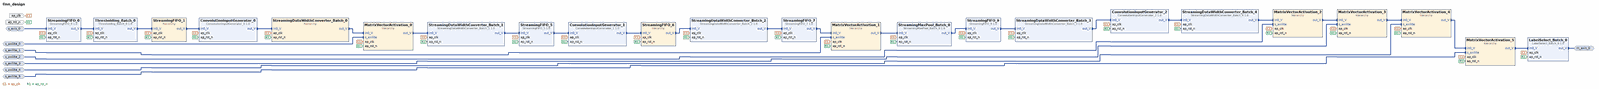
[diagram p0: block diagram of the top level, whole]
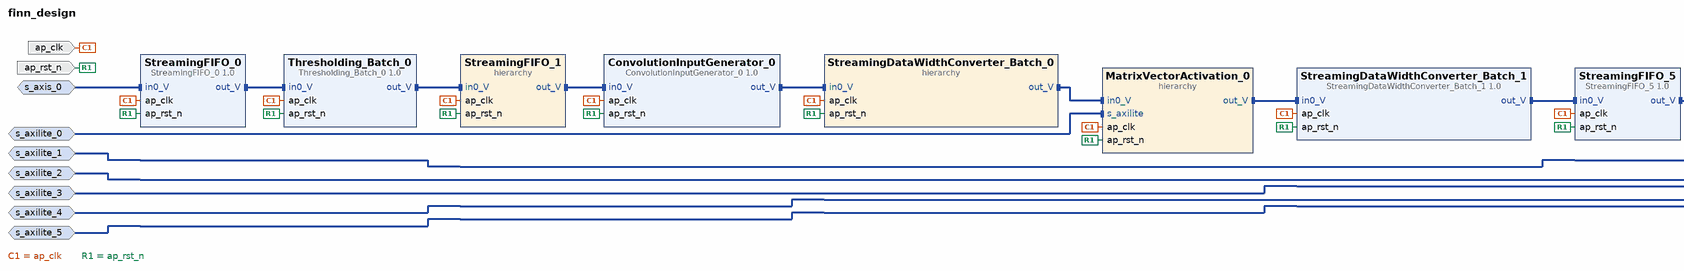
[diagram p1: block diagram of the top level, left part]
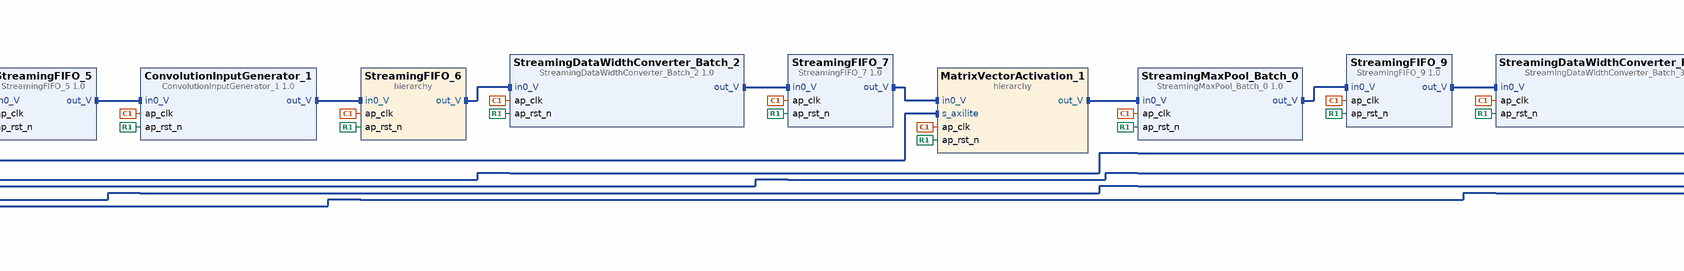
[diagram p2: block diagram of the top level, centre part]
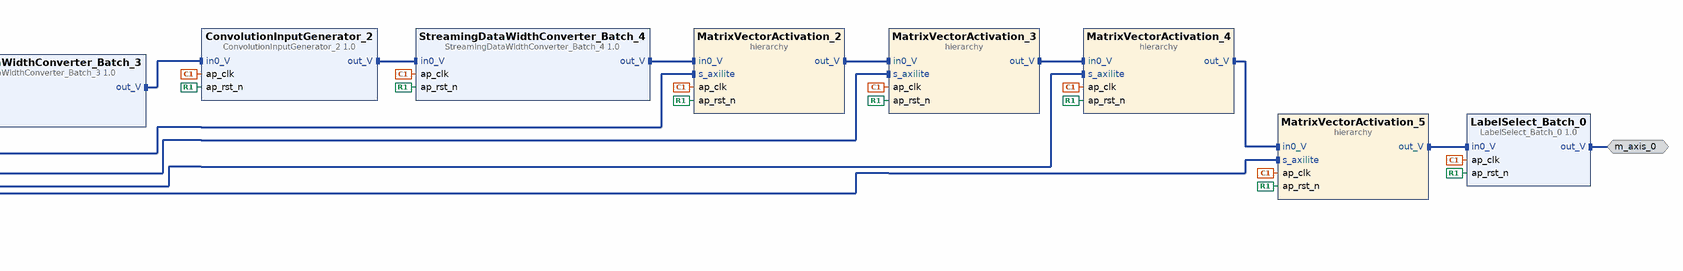
[diagram p3: block diagram of the top level, right part]
# Vivado block design finn_design, xc7z020clg400-1, Vivado 2022.2.2
create_bd_design finn_design

create_bd_intf_port -mode Slave -vlnv xilinx.com:interface:aximm_rtl:1.0 s_axilite_0
set_property -dict [list \
  CONFIG.ADDR_WIDTH 7 \
  CONFIG.ARUSER_WIDTH 0 \
  CONFIG.AWUSER_WIDTH 0 \
  CONFIG.BUSER_WIDTH 0 \
  CONFIG.DATA_WIDTH 32 \
  CONFIG.FREQ_HZ 100000000.000000 \
  CONFIG.HAS_BRESP 1 \
  CONFIG.HAS_BURST 0 \
  CONFIG.HAS_CACHE 0 \
  CONFIG.HAS_LOCK 0 \
  CONFIG.HAS_PROT 1 \
  CONFIG.HAS_QOS 0 \
  CONFIG.HAS_REGION 0 \
  CONFIG.HAS_RRESP 1 \
  CONFIG.HAS_WSTRB 1 \
  CONFIG.ID_WIDTH 0 \
  CONFIG.MAX_BURST_LENGTH 1 \
  CONFIG.NUM_READ_OUTSTANDING 1 \
  CONFIG.NUM_READ_THREADS 1 \
  CONFIG.NUM_WRITE_OUTSTANDING 1 \
  CONFIG.NUM_WRITE_THREADS 1 \
  CONFIG.PROTOCOL AXI4LITE \
  CONFIG.READ_WRITE_MODE READ_WRITE \
  CONFIG.RUSER_BITS_PER_BYTE 0 \
  CONFIG.RUSER_WIDTH 0 \
  CONFIG.SUPPORTS_NARROW_BURST 0 \
  CONFIG.WUSER_BITS_PER_BYTE 0 \
  CONFIG.WUSER_WIDTH 0 \
] [get_bd_intf_ports s_axilite_0]
create_bd_intf_port -mode Slave -vlnv xilinx.com:interface:aximm_rtl:1.0 s_axilite_1
set_property -dict [list \
  CONFIG.ADDR_WIDTH 12 \
  CONFIG.ARUSER_WIDTH 0 \
  CONFIG.AWUSER_WIDTH 0 \
  CONFIG.BUSER_WIDTH 0 \
  CONFIG.DATA_WIDTH 32 \
  CONFIG.FREQ_HZ 100000000.000000 \
  CONFIG.HAS_BRESP 1 \
  CONFIG.HAS_BURST 0 \
  CONFIG.HAS_CACHE 0 \
  CONFIG.HAS_LOCK 0 \
  CONFIG.HAS_PROT 1 \
  CONFIG.HAS_QOS 0 \
  CONFIG.HAS_REGION 0 \
  CONFIG.HAS_RRESP 1 \
  CONFIG.HAS_WSTRB 1 \
  CONFIG.ID_WIDTH 0 \
  CONFIG.MAX_BURST_LENGTH 1 \
  CONFIG.NUM_READ_OUTSTANDING 1 \
  CONFIG.NUM_READ_THREADS 1 \
  CONFIG.NUM_WRITE_OUTSTANDING 1 \
  CONFIG.NUM_WRITE_THREADS 1 \
  CONFIG.PROTOCOL AXI4LITE \
  CONFIG.READ_WRITE_MODE READ_WRITE \
  CONFIG.RUSER_BITS_PER_BYTE 0 \
  CONFIG.RUSER_WIDTH 0 \
  CONFIG.SUPPORTS_NARROW_BURST 0 \
  CONFIG.WUSER_BITS_PER_BYTE 0 \
  CONFIG.WUSER_WIDTH 0 \
] [get_bd_intf_ports s_axilite_1]
create_bd_intf_port -mode Slave -vlnv xilinx.com:interface:aximm_rtl:1.0 s_axilite_2
set_property -dict [list \
  CONFIG.ADDR_WIDTH 15 \
  CONFIG.ARUSER_WIDTH 0 \
  CONFIG.AWUSER_WIDTH 0 \
  CONFIG.BUSER_WIDTH 0 \
  CONFIG.DATA_WIDTH 32 \
  CONFIG.FREQ_HZ 100000000.000000 \
  CONFIG.HAS_BRESP 1 \
  CONFIG.HAS_BURST 0 \
  CONFIG.HAS_CACHE 0 \
  CONFIG.HAS_LOCK 0 \
  CONFIG.HAS_PROT 1 \
  CONFIG.HAS_QOS 0 \
  CONFIG.HAS_REGION 0 \
  CONFIG.HAS_RRESP 1 \
  CONFIG.HAS_WSTRB 1 \
  CONFIG.ID_WIDTH 0 \
  CONFIG.MAX_BURST_LENGTH 1 \
  CONFIG.NUM_READ_OUTSTANDING 1 \
  CONFIG.NUM_READ_THREADS 1 \
  CONFIG.NUM_WRITE_OUTSTANDING 1 \
  CONFIG.NUM_WRITE_THREADS 1 \
  CONFIG.PROTOCOL AXI4LITE \
  CONFIG.READ_WRITE_MODE READ_WRITE \
  CONFIG.RUSER_BITS_PER_BYTE 0 \
  CONFIG.RUSER_WIDTH 0 \
  CONFIG.SUPPORTS_NARROW_BURST 0 \
  CONFIG.WUSER_BITS_PER_BYTE 0 \
  CONFIG.WUSER_WIDTH 0 \
] [get_bd_intf_ports s_axilite_2]
create_bd_intf_port -mode Slave -vlnv xilinx.com:interface:aximm_rtl:1.0 s_axilite_3
set_property -dict [list \
  CONFIG.ADDR_WIDTH 11 \
  CONFIG.ARUSER_WIDTH 0 \
  CONFIG.AWUSER_WIDTH 0 \
  CONFIG.BUSER_WIDTH 0 \
  CONFIG.DATA_WIDTH 32 \
  CONFIG.FREQ_HZ 100000000.000000 \
  CONFIG.HAS_BRESP 1 \
  CONFIG.HAS_BURST 0 \
  CONFIG.HAS_CACHE 0 \
  CONFIG.HAS_LOCK 0 \
  CONFIG.HAS_PROT 1 \
  CONFIG.HAS_QOS 0 \
  CONFIG.HAS_REGION 0 \
  CONFIG.HAS_RRESP 1 \
  CONFIG.HAS_WSTRB 1 \
  CONFIG.ID_WIDTH 0 \
  CONFIG.MAX_BURST_LENGTH 1 \
  CONFIG.NUM_READ_OUTSTANDING 1 \
  CONFIG.NUM_READ_THREADS 1 \
  CONFIG.NUM_WRITE_OUTSTANDING 1 \
  CONFIG.NUM_WRITE_THREADS 1 \
  CONFIG.PROTOCOL AXI4LITE \
  CONFIG.READ_WRITE_MODE READ_WRITE \
  CONFIG.RUSER_BITS_PER_BYTE 0 \
  CONFIG.RUSER_WIDTH 0 \
  CONFIG.SUPPORTS_NARROW_BURST 0 \
  CONFIG.WUSER_BITS_PER_BYTE 0 \
  CONFIG.WUSER_WIDTH 0 \
] [get_bd_intf_ports s_axilite_3]
create_bd_intf_port -mode Slave -vlnv xilinx.com:interface:aximm_rtl:1.0 s_axilite_4
set_property -dict [list \
  CONFIG.ADDR_WIDTH 10 \
  CONFIG.ARUSER_WIDTH 0 \
  CONFIG.AWUSER_WIDTH 0 \
  CONFIG.BUSER_WIDTH 0 \
  CONFIG.DATA_WIDTH 32 \
  CONFIG.FREQ_HZ 100000000.000000 \
  CONFIG.HAS_BRESP 1 \
  CONFIG.HAS_BURST 0 \
  CONFIG.HAS_CACHE 0 \
  CONFIG.HAS_LOCK 0 \
  CONFIG.HAS_PROT 1 \
  CONFIG.HAS_QOS 0 \
  CONFIG.HAS_REGION 0 \
  CONFIG.HAS_RRESP 1 \
  CONFIG.HAS_WSTRB 1 \
  CONFIG.ID_WIDTH 0 \
  CONFIG.MAX_BURST_LENGTH 1 \
  CONFIG.NUM_READ_OUTSTANDING 1 \
  CONFIG.NUM_READ_THREADS 1 \
  CONFIG.NUM_WRITE_OUTSTANDING 1 \
  CONFIG.NUM_WRITE_THREADS 1 \
  CONFIG.PROTOCOL AXI4LITE \
  CONFIG.READ_WRITE_MODE READ_WRITE \
  CONFIG.RUSER_BITS_PER_BYTE 0 \
  CONFIG.RUSER_WIDTH 0 \
  CONFIG.SUPPORTS_NARROW_BURST 0 \
  CONFIG.WUSER_BITS_PER_BYTE 0 \
  CONFIG.WUSER_WIDTH 0 \
] [get_bd_intf_ports s_axilite_4]
create_bd_intf_port -mode Slave -vlnv xilinx.com:interface:aximm_rtl:1.0 s_axilite_5
set_property -dict [list \
  CONFIG.ADDR_WIDTH 9 \
  CONFIG.ARUSER_WIDTH 0 \
  CONFIG.AWUSER_WIDTH 0 \
  CONFIG.BUSER_WIDTH 0 \
  CONFIG.DATA_WIDTH 32 \
  CONFIG.FREQ_HZ 100000000.000000 \
  CONFIG.HAS_BRESP 1 \
  CONFIG.HAS_BURST 0 \
  CONFIG.HAS_CACHE 0 \
  CONFIG.HAS_LOCK 0 \
  CONFIG.HAS_PROT 1 \
  CONFIG.HAS_QOS 0 \
  CONFIG.HAS_REGION 0 \
  CONFIG.HAS_RRESP 1 \
  CONFIG.HAS_WSTRB 1 \
  CONFIG.ID_WIDTH 0 \
  CONFIG.MAX_BURST_LENGTH 1 \
  CONFIG.NUM_READ_OUTSTANDING 1 \
  CONFIG.NUM_READ_THREADS 1 \
  CONFIG.NUM_WRITE_OUTSTANDING 1 \
  CONFIG.NUM_WRITE_THREADS 1 \
  CONFIG.PROTOCOL AXI4LITE \
  CONFIG.READ_WRITE_MODE READ_WRITE \
  CONFIG.RUSER_BITS_PER_BYTE 0 \
  CONFIG.RUSER_WIDTH 0 \
  CONFIG.SUPPORTS_NARROW_BURST 0 \
  CONFIG.WUSER_BITS_PER_BYTE 0 \
  CONFIG.WUSER_WIDTH 0 \
] [get_bd_intf_ports s_axilite_5]
create_bd_intf_port -mode Slave -vlnv xilinx.com:interface:axis_rtl:1.0 s_axis_0
set_property -dict [list \
  CONFIG.FREQ_HZ 100000000.000000 \
  CONFIG.HAS_TKEEP 0 \
  CONFIG.HAS_TLAST 0 \
  CONFIG.HAS_TREADY 1 \
  CONFIG.HAS_TSTRB 0 \
  CONFIG.LAYERED_METADATA undef \
  CONFIG.TDATA_NUM_BYTES 1 \
  CONFIG.TDEST_WIDTH 0 \
  CONFIG.TID_WIDTH 0 \
  CONFIG.TUSER_WIDTH 0 \
] [get_bd_intf_ports s_axis_0]
create_bd_intf_port -mode Master -vlnv xilinx.com:interface:axis_rtl:1.0 m_axis_0
set_property -dict {CONFIG.FREQ_HZ 100000000.000000} [get_bd_intf_ports m_axis_0]
create_bd_port -dir I -type clk ap_clk
set_property -dict {CONFIG.FREQ_HZ 100000000.000000} [get_bd_ports ap_clk]
create_bd_port -dir I -type rst ap_rst_n

create_bd_cell -type ip -vlnv xilinx.com:hls:StreamingFIFO_0:1.0 StreamingFIFO_0
create_bd_cell -type ip -vlnv xilinx.com:hls:Thresholding_Batch_0:1.0 Thresholding_Batch_0
create_bd_cell -type hier StreamingFIFO_1
create_bd_cell -type ip -vlnv xilinx.com:hls:ConvolutionInputGenerator_0:1.0 ConvolutionInputGenerator_0
create_bd_cell -type hier StreamingDataWidthConverter_Batch_0
create_bd_cell -type hier MatrixVectorActivation_0
create_bd_cell -type ip -vlnv xilinx.com:hls:StreamingDataWidthConverter_Batch_1:1.0 StreamingDataWidthConverter_Batch_1
create_bd_cell -type ip -vlnv xilinx.com:hls:StreamingFIFO_5:1.0 StreamingFIFO_5
create_bd_cell -type ip -vlnv xilinx.com:hls:ConvolutionInputGenerator_1:1.0 ConvolutionInputGenerator_1
create_bd_cell -type hier StreamingFIFO_6
create_bd_cell -type ip -vlnv xilinx.com:hls:StreamingDataWidthConverter_Batch_2:1.0 StreamingDataWidthConverter_Batch_2
create_bd_cell -type ip -vlnv xilinx.com:hls:StreamingFIFO_7:1.0 StreamingFIFO_7
create_bd_cell -type hier MatrixVectorActivation_1
create_bd_cell -type ip -vlnv xilinx.com:hls:StreamingMaxPool_Batch_0:1.0 StreamingMaxPool_Batch_0
create_bd_cell -type ip -vlnv xilinx.com:hls:StreamingFIFO_9:1.0 StreamingFIFO_9
create_bd_cell -type ip -vlnv xilinx.com:hls:StreamingDataWidthConverter_Batch_3:1.0 StreamingDataWidthConverter_Batch_3
create_bd_cell -type ip -vlnv xilinx.com:hls:ConvolutionInputGenerator_2:1.0 ConvolutionInputGenerator_2
create_bd_cell -type ip -vlnv xilinx.com:hls:StreamingDataWidthConverter_Batch_4:1.0 StreamingDataWidthConverter_Batch_4
create_bd_cell -type hier MatrixVectorActivation_2
create_bd_cell -type hier MatrixVectorActivation_3
create_bd_cell -type hier MatrixVectorActivation_4
create_bd_cell -type hier MatrixVectorActivation_5
create_bd_cell -type ip -vlnv xilinx.com:hls:LabelSelect_Batch_0:1.0 LabelSelect_Batch_0

# ---- hierarchy /StreamingFIFO_1 ----
current_bd_instance /StreamingFIFO_1
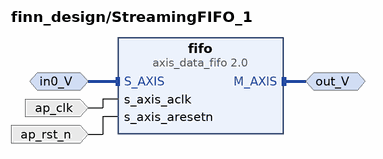
[diagram p4: block diagram inside /StreamingFIFO_1]
create_bd_intf_pin -mode Master -vlnv xilinx.com:interface:axis_rtl:1.0 out_V
create_bd_intf_pin -mode Slave -vlnv xilinx.com:interface:axis_rtl:1.0 in0_V
create_bd_pin -dir I -type clk ap_clk
create_bd_pin -dir I -type rst ap_rst_n

create_bd_cell -type ip -vlnv xilinx.com:ip:axis_data_fifo:2.0 fifo
set_property -dict {CONFIG.FIFO_DEPTH 512 CONFIG.FIFO_MEMORY_TYPE auto CONFIG.TDATA_NUM_BYTES 1} [get_bd_cells fifo]

# ---- hierarchy /StreamingDataWidthConverter_Batch_0 ----
current_bd_instance /StreamingDataWidthConverter_Batch_0
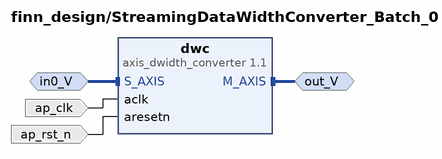
[diagram p5: block diagram inside /StreamingDataWidthConverter_Batch_0]
create_bd_intf_pin -mode Master -vlnv xilinx.com:interface:axis_rtl:1.0 out_V
create_bd_intf_pin -mode Slave -vlnv xilinx.com:interface:axis_rtl:1.0 in0_V
create_bd_pin -dir I -type clk ap_clk
create_bd_pin -dir I -type rst ap_rst_n

create_bd_cell -type ip -vlnv xilinx.com:ip:axis_dwidth_converter:1.1 dwc
set_property -dict {CONFIG.M_TDATA_NUM_BYTES 9 CONFIG.S_TDATA_NUM_BYTES 1} [get_bd_cells dwc]

# ---- hierarchy /MatrixVectorActivation_0 ----
current_bd_instance /MatrixVectorActivation_0
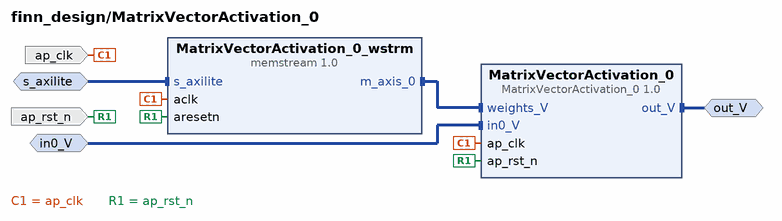
[diagram p6: block diagram inside /MatrixVectorActivation_0]
create_bd_intf_pin -mode Master -vlnv xilinx.com:interface:axis_rtl:1.0 out_V
create_bd_intf_pin -mode Slave -vlnv xilinx.com:interface:axis_rtl:1.0 in0_V
create_bd_intf_pin -mode Slave -vlnv xilinx.com:interface:aximm_rtl:1.0 s_axilite
create_bd_pin -dir I -type clk ap_clk
create_bd_pin -dir I -type rst ap_rst_n

create_bd_cell -type ip -vlnv xilinx.com:hls:MatrixVectorActivation_0:1.0 MatrixVectorActivation_0
create_bd_cell -type ip -vlnv xilinx.com:user:memstream:1.0 MatrixVectorActivation_0_wstrm
set_property -dict [list \
  CONFIG.MEM_DEPTH 28 \
  CONFIG.MEM_INIT /tmp/finn_dev_shakeelarkam00/code_gen_ipgen_MatrixVectorActivation_0_0xiospj5/ \
  CONFIG.MEM_WIDTH 32 \
  CONFIG.NSTREAMS 1 \
  CONFIG.RAM_STYLE auto \
  CONFIG.STRM0_DEPTH 28 \
  CONFIG.STRM0_OFFSET 0 \
  CONFIG.STRM0_WIDTH 32 \
] [get_bd_cells MatrixVectorActivation_0_wstrm]

# ---- hierarchy /StreamingFIFO_6 ----
current_bd_instance /StreamingFIFO_6
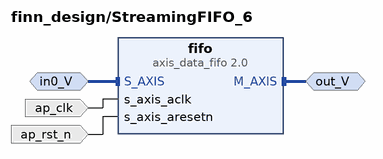
[diagram p7: block diagram inside /StreamingFIFO_6]
create_bd_intf_pin -mode Master -vlnv xilinx.com:interface:axis_rtl:1.0 out_V
create_bd_intf_pin -mode Slave -vlnv xilinx.com:interface:axis_rtl:1.0 in0_V
create_bd_pin -dir I -type clk ap_clk
create_bd_pin -dir I -type rst ap_rst_n

create_bd_cell -type ip -vlnv xilinx.com:ip:axis_data_fifo:2.0 fifo
set_property -dict {CONFIG.FIFO_DEPTH 4096 CONFIG.FIFO_MEMORY_TYPE auto CONFIG.TDATA_NUM_BYTES 3} [get_bd_cells fifo]

# ---- hierarchy /MatrixVectorActivation_1 ----
current_bd_instance /MatrixVectorActivation_1
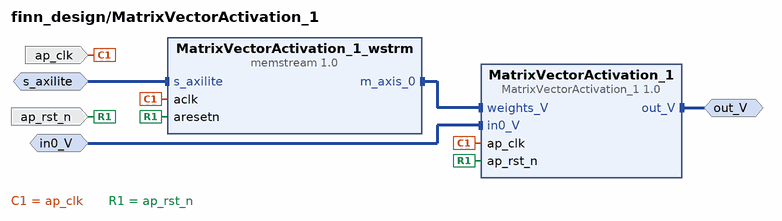
[diagram p8: block diagram inside /MatrixVectorActivation_1]
create_bd_intf_pin -mode Master -vlnv xilinx.com:interface:axis_rtl:1.0 out_V
create_bd_intf_pin -mode Slave -vlnv xilinx.com:interface:axis_rtl:1.0 in0_V
create_bd_intf_pin -mode Slave -vlnv xilinx.com:interface:aximm_rtl:1.0 s_axilite
create_bd_pin -dir I -type clk ap_clk
create_bd_pin -dir I -type rst ap_rst_n

create_bd_cell -type ip -vlnv xilinx.com:hls:MatrixVectorActivation_1:1.0 MatrixVectorActivation_1
create_bd_cell -type ip -vlnv xilinx.com:user:memstream:1.0 MatrixVectorActivation_1_wstrm
set_property -dict [list \
  CONFIG.MEM_DEPTH 84 \
  CONFIG.MEM_INIT /tmp/finn_dev_shakeelarkam00/code_gen_ipgen_MatrixVectorActivation_1_uhotd8eg/ \
  CONFIG.MEM_WIDTH 192 \
  CONFIG.NSTREAMS 1 \
  CONFIG.RAM_STYLE auto \
  CONFIG.STRM0_DEPTH 84 \
  CONFIG.STRM0_OFFSET 0 \
  CONFIG.STRM0_WIDTH 192 \
] [get_bd_cells MatrixVectorActivation_1_wstrm]

# ---- hierarchy /MatrixVectorActivation_2 ----
current_bd_instance /MatrixVectorActivation_2
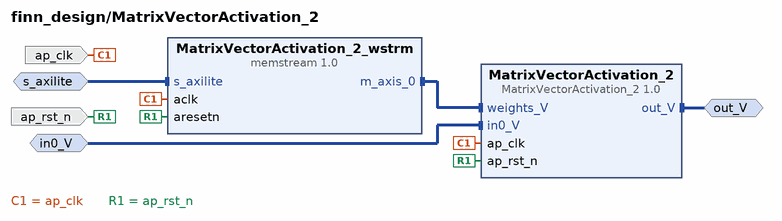
[diagram p9: block diagram inside /MatrixVectorActivation_2]
create_bd_intf_pin -mode Master -vlnv xilinx.com:interface:axis_rtl:1.0 out_V
create_bd_intf_pin -mode Slave -vlnv xilinx.com:interface:axis_rtl:1.0 in0_V
create_bd_intf_pin -mode Slave -vlnv xilinx.com:interface:aximm_rtl:1.0 s_axilite
create_bd_pin -dir I -type clk ap_clk
create_bd_pin -dir I -type rst ap_rst_n

create_bd_cell -type ip -vlnv xilinx.com:hls:MatrixVectorActivation_2:1.0 MatrixVectorActivation_2
create_bd_cell -type ip -vlnv xilinx.com:user:memstream:1.0 MatrixVectorActivation_2_wstrm
set_property -dict [list \
  CONFIG.MEM_DEPTH 7938 \
  CONFIG.MEM_INIT /tmp/finn_dev_shakeelarkam00/code_gen_ipgen_MatrixVectorActivation_2_539kjxr7/ \
  CONFIG.MEM_WIDTH 8 \
  CONFIG.NSTREAMS 1 \
  CONFIG.RAM_STYLE auto \
  CONFIG.STRM0_DEPTH 7938 \
  CONFIG.STRM0_OFFSET 0 \
  CONFIG.STRM0_WIDTH 8 \
] [get_bd_cells MatrixVectorActivation_2_wstrm]

# ---- hierarchy /MatrixVectorActivation_3 ----
current_bd_instance /MatrixVectorActivation_3
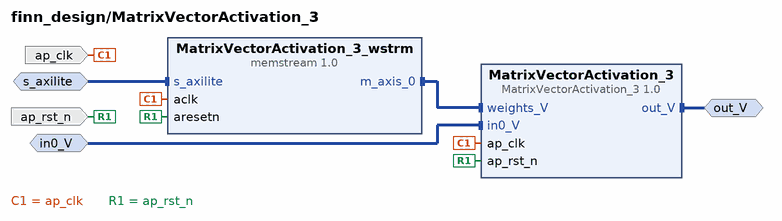
[diagram p10: block diagram inside /MatrixVectorActivation_3]
create_bd_intf_pin -mode Master -vlnv xilinx.com:interface:axis_rtl:1.0 out_V
create_bd_intf_pin -mode Slave -vlnv xilinx.com:interface:axis_rtl:1.0 in0_V
create_bd_intf_pin -mode Slave -vlnv xilinx.com:interface:aximm_rtl:1.0 s_axilite
create_bd_pin -dir I -type clk ap_clk
create_bd_pin -dir I -type rst ap_rst_n

create_bd_cell -type ip -vlnv xilinx.com:hls:MatrixVectorActivation_3:1.0 MatrixVectorActivation_3
create_bd_cell -type ip -vlnv xilinx.com:user:memstream:1.0 MatrixVectorActivation_3_wstrm
set_property -dict [list \
  CONFIG.MEM_DEPTH 336 \
  CONFIG.MEM_INIT /tmp/finn_dev_shakeelarkam00/code_gen_ipgen_MatrixVectorActivation_3_nupkdj_i/ \
  CONFIG.MEM_WIDTH 8 \
  CONFIG.NSTREAMS 1 \
  CONFIG.RAM_STYLE auto \
  CONFIG.STRM0_DEPTH 336 \
  CONFIG.STRM0_OFFSET 0 \
  CONFIG.STRM0_WIDTH 8 \
] [get_bd_cells MatrixVectorActivation_3_wstrm]

# ---- hierarchy /MatrixVectorActivation_4 ----
current_bd_instance /MatrixVectorActivation_4
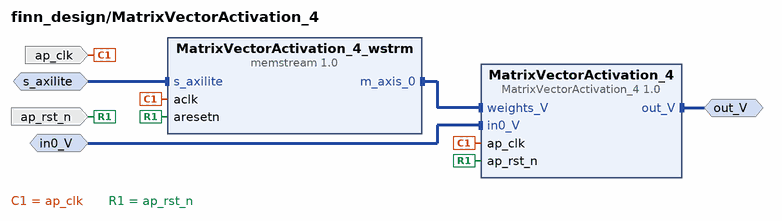
[diagram p11: block diagram inside /MatrixVectorActivation_4]
create_bd_intf_pin -mode Master -vlnv xilinx.com:interface:axis_rtl:1.0 out_V
create_bd_intf_pin -mode Slave -vlnv xilinx.com:interface:axis_rtl:1.0 in0_V
create_bd_intf_pin -mode Slave -vlnv xilinx.com:interface:aximm_rtl:1.0 s_axilite
create_bd_pin -dir I -type clk ap_clk
create_bd_pin -dir I -type rst ap_rst_n

create_bd_cell -type ip -vlnv xilinx.com:hls:MatrixVectorActivation_4:1.0 MatrixVectorActivation_4
create_bd_cell -type ip -vlnv xilinx.com:user:memstream:1.0 MatrixVectorActivation_4_wstrm
set_property -dict [list \
  CONFIG.MEM_DEPTH 256 \
  CONFIG.MEM_INIT /tmp/finn_dev_shakeelarkam00/code_gen_ipgen_MatrixVectorActivation_4_71mmt5md/ \
  CONFIG.MEM_WIDTH 8 \
  CONFIG.NSTREAMS 1 \
  CONFIG.RAM_STYLE auto \
  CONFIG.STRM0_DEPTH 256 \
  CONFIG.STRM0_OFFSET 0 \
  CONFIG.STRM0_WIDTH 8 \
] [get_bd_cells MatrixVectorActivation_4_wstrm]

# ---- hierarchy /MatrixVectorActivation_5 ----
current_bd_instance /MatrixVectorActivation_5
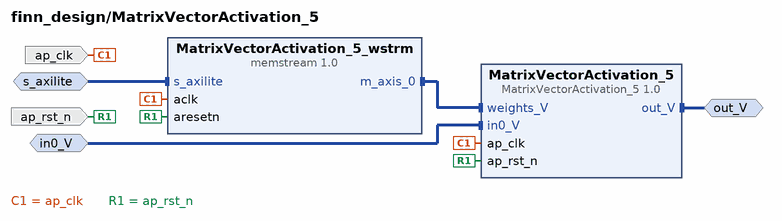
[diagram p12: block diagram inside /MatrixVectorActivation_5]
create_bd_intf_pin -mode Master -vlnv xilinx.com:interface:axis_rtl:1.0 out_V
create_bd_intf_pin -mode Slave -vlnv xilinx.com:interface:axis_rtl:1.0 in0_V
create_bd_intf_pin -mode Slave -vlnv xilinx.com:interface:aximm_rtl:1.0 s_axilite
create_bd_pin -dir I -type clk ap_clk
create_bd_pin -dir I -type rst ap_rst_n

create_bd_cell -type ip -vlnv xilinx.com:hls:MatrixVectorActivation_5:1.0 MatrixVectorActivation_5
create_bd_cell -type ip -vlnv xilinx.com:user:memstream:1.0 MatrixVectorActivation_5_wstrm
set_property -dict [list \
  CONFIG.MEM_DEPTH 80 \
  CONFIG.MEM_INIT /tmp/finn_dev_shakeelarkam00/code_gen_ipgen_MatrixVectorActivation_5_736cdvx1/ \
  CONFIG.MEM_WIDTH 8 \
  CONFIG.NSTREAMS 1 \
  CONFIG.RAM_STYLE auto \
  CONFIG.STRM0_DEPTH 80 \
  CONFIG.STRM0_OFFSET 0 \
  CONFIG.STRM0_WIDTH 8 \
] [get_bd_cells MatrixVectorActivation_5_wstrm]

# ---- connections ----

current_bd_instance /StreamingFIFO_1
connect_bd_intf_net [get_bd_intf_pins out_V] [get_bd_intf_pins fifo/M_AXIS]
connect_bd_intf_net [get_bd_intf_pins in0_V] [get_bd_intf_pins fifo/S_AXIS]
connect_bd_net [get_bd_pins ap_clk] [get_bd_pins fifo/s_axis_aclk]
connect_bd_net [get_bd_pins ap_rst_n] [get_bd_pins fifo/s_axis_aresetn]

current_bd_instance /StreamingDataWidthConverter_Batch_0
connect_bd_intf_net [get_bd_intf_pins out_V] [get_bd_intf_pins dwc/M_AXIS]
connect_bd_intf_net [get_bd_intf_pins in0_V] [get_bd_intf_pins dwc/S_AXIS]
connect_bd_net [get_bd_pins ap_clk] [get_bd_pins dwc/aclk]
connect_bd_net [get_bd_pins ap_rst_n] [get_bd_pins dwc/aresetn]

current_bd_instance /MatrixVectorActivation_0
connect_bd_intf_net [get_bd_intf_pins out_V] [get_bd_intf_pins MatrixVectorActivation_0/out_V]
connect_bd_intf_net [get_bd_intf_pins MatrixVectorActivation_0_wstrm/m_axis_0] [get_bd_intf_pins MatrixVectorActivation_0/weights_V]
connect_bd_intf_net [get_bd_intf_pins in0_V] [get_bd_intf_pins MatrixVectorActivation_0/in0_V]
connect_bd_intf_net [get_bd_intf_pins s_axilite] [get_bd_intf_pins MatrixVectorActivation_0_wstrm/s_axilite]
connect_bd_net [get_bd_pins ap_clk] [get_bd_pins MatrixVectorActivation_0_wstrm/aclk] [get_bd_pins MatrixVectorActivation_0/ap_clk]
connect_bd_net [get_bd_pins ap_rst_n] [get_bd_pins MatrixVectorActivation_0_wstrm/aresetn] [get_bd_pins MatrixVectorActivation_0/ap_rst_n]

current_bd_instance /StreamingFIFO_6
connect_bd_intf_net [get_bd_intf_pins out_V] [get_bd_intf_pins fifo/M_AXIS]
connect_bd_intf_net [get_bd_intf_pins in0_V] [get_bd_intf_pins fifo/S_AXIS]
connect_bd_net [get_bd_pins ap_clk] [get_bd_pins fifo/s_axis_aclk]
connect_bd_net [get_bd_pins ap_rst_n] [get_bd_pins fifo/s_axis_aresetn]

current_bd_instance /MatrixVectorActivation_1
connect_bd_intf_net [get_bd_intf_pins out_V] [get_bd_intf_pins MatrixVectorActivation_1/out_V]
connect_bd_intf_net [get_bd_intf_pins MatrixVectorActivation_1_wstrm/m_axis_0] [get_bd_intf_pins MatrixVectorActivation_1/weights_V]
connect_bd_intf_net [get_bd_intf_pins in0_V] [get_bd_intf_pins MatrixVectorActivation_1/in0_V]
connect_bd_intf_net [get_bd_intf_pins s_axilite] [get_bd_intf_pins MatrixVectorActivation_1_wstrm/s_axilite]
connect_bd_net [get_bd_pins ap_clk] [get_bd_pins MatrixVectorActivation_1_wstrm/aclk] [get_bd_pins MatrixVectorActivation_1/ap_clk]
connect_bd_net [get_bd_pins ap_rst_n] [get_bd_pins MatrixVectorActivation_1_wstrm/aresetn] [get_bd_pins MatrixVectorActivation_1/ap_rst_n]

current_bd_instance /MatrixVectorActivation_2
connect_bd_intf_net [get_bd_intf_pins out_V] [get_bd_intf_pins MatrixVectorActivation_2/out_V]
connect_bd_intf_net [get_bd_intf_pins MatrixVectorActivation_2_wstrm/m_axis_0] [get_bd_intf_pins MatrixVectorActivation_2/weights_V]
connect_bd_intf_net [get_bd_intf_pins in0_V] [get_bd_intf_pins MatrixVectorActivation_2/in0_V]
connect_bd_intf_net [get_bd_intf_pins s_axilite] [get_bd_intf_pins MatrixVectorActivation_2_wstrm/s_axilite]
connect_bd_net [get_bd_pins ap_clk] [get_bd_pins MatrixVectorActivation_2_wstrm/aclk] [get_bd_pins MatrixVectorActivation_2/ap_clk]
connect_bd_net [get_bd_pins ap_rst_n] [get_bd_pins MatrixVectorActivation_2_wstrm/aresetn] [get_bd_pins MatrixVectorActivation_2/ap_rst_n]

current_bd_instance /MatrixVectorActivation_3
connect_bd_intf_net [get_bd_intf_pins out_V] [get_bd_intf_pins MatrixVectorActivation_3/out_V]
connect_bd_intf_net [get_bd_intf_pins MatrixVectorActivation_3_wstrm/m_axis_0] [get_bd_intf_pins MatrixVectorActivation_3/weights_V]
connect_bd_intf_net [get_bd_intf_pins in0_V] [get_bd_intf_pins MatrixVectorActivation_3/in0_V]
connect_bd_intf_net [get_bd_intf_pins s_axilite] [get_bd_intf_pins MatrixVectorActivation_3_wstrm/s_axilite]
connect_bd_net [get_bd_pins ap_clk] [get_bd_pins MatrixVectorActivation_3_wstrm/aclk] [get_bd_pins MatrixVectorActivation_3/ap_clk]
connect_bd_net [get_bd_pins ap_rst_n] [get_bd_pins MatrixVectorActivation_3_wstrm/aresetn] [get_bd_pins MatrixVectorActivation_3/ap_rst_n]

current_bd_instance /MatrixVectorActivation_4
connect_bd_intf_net [get_bd_intf_pins out_V] [get_bd_intf_pins MatrixVectorActivation_4/out_V]
connect_bd_intf_net [get_bd_intf_pins MatrixVectorActivation_4_wstrm/m_axis_0] [get_bd_intf_pins MatrixVectorActivation_4/weights_V]
connect_bd_intf_net [get_bd_intf_pins in0_V] [get_bd_intf_pins MatrixVectorActivation_4/in0_V]
connect_bd_intf_net [get_bd_intf_pins s_axilite] [get_bd_intf_pins MatrixVectorActivation_4_wstrm/s_axilite]
connect_bd_net [get_bd_pins ap_clk] [get_bd_pins MatrixVectorActivation_4_wstrm/aclk] [get_bd_pins MatrixVectorActivation_4/ap_clk]
connect_bd_net [get_bd_pins ap_rst_n] [get_bd_pins MatrixVectorActivation_4_wstrm/aresetn] [get_bd_pins MatrixVectorActivation_4/ap_rst_n]

current_bd_instance /MatrixVectorActivation_5
connect_bd_intf_net [get_bd_intf_pins out_V] [get_bd_intf_pins MatrixVectorActivation_5/out_V]
connect_bd_intf_net [get_bd_intf_pins MatrixVectorActivation_5_wstrm/m_axis_0] [get_bd_intf_pins MatrixVectorActivation_5/weights_V]
connect_bd_intf_net [get_bd_intf_pins in0_V] [get_bd_intf_pins MatrixVectorActivation_5/in0_V]
connect_bd_intf_net [get_bd_intf_pins s_axilite] [get_bd_intf_pins MatrixVectorActivation_5_wstrm/s_axilite]
connect_bd_net [get_bd_pins ap_clk] [get_bd_pins MatrixVectorActivation_5_wstrm/aclk] [get_bd_pins MatrixVectorActivation_5/ap_clk]
connect_bd_net [get_bd_pins ap_rst_n] [get_bd_pins MatrixVectorActivation_5_wstrm/aresetn] [get_bd_pins MatrixVectorActivation_5/ap_rst_n]

current_bd_instance /
connect_bd_intf_net [get_bd_intf_pins ConvolutionInputGenerator_0/out_V] [get_bd_intf_pins StreamingDataWidthConverter_Batch_0/in0_V]
connect_bd_intf_net [get_bd_intf_pins ConvolutionInputGenerator_1/out_V] [get_bd_intf_pins StreamingFIFO_6/in0_V]
connect_bd_intf_net [get_bd_intf_pins ConvolutionInputGenerator_2/out_V] [get_bd_intf_pins StreamingDataWidthConverter_Batch_4/in0_V]
connect_bd_intf_net [get_bd_intf_ports m_axis_0] [get_bd_intf_pins LabelSelect_Batch_0/out_V]
connect_bd_intf_net [get_bd_intf_pins MatrixVectorActivation_0/out_V] [get_bd_intf_pins StreamingDataWidthConverter_Batch_1/in0_V]
connect_bd_intf_net [get_bd_intf_pins MatrixVectorActivation_1/out_V] [get_bd_intf_pins StreamingMaxPool_Batch_0/in0_V]
connect_bd_intf_net [get_bd_intf_pins MatrixVectorActivation_2/out_V] [get_bd_intf_pins MatrixVectorActivation_3/in0_V]
connect_bd_intf_net [get_bd_intf_pins MatrixVectorActivation_3/out_V] [get_bd_intf_pins MatrixVectorActivation_4/in0_V]
connect_bd_intf_net [get_bd_intf_pins MatrixVectorActivation_4/out_V] [get_bd_intf_pins MatrixVectorActivation_5/in0_V]
connect_bd_intf_net [get_bd_intf_pins MatrixVectorActivation_5/out_V] [get_bd_intf_pins LabelSelect_Batch_0/in0_V]
connect_bd_intf_net [get_bd_intf_pins StreamingDataWidthConverter_Batch_0/out_V] [get_bd_intf_pins MatrixVectorActivation_0/in0_V]
connect_bd_intf_net [get_bd_intf_pins StreamingDataWidthConverter_Batch_1/out_V] [get_bd_intf_pins StreamingFIFO_5/in0_V]
connect_bd_intf_net [get_bd_intf_pins StreamingDataWidthConverter_Batch_2/out_V] [get_bd_intf_pins StreamingFIFO_7/in0_V]
connect_bd_intf_net [get_bd_intf_pins StreamingDataWidthConverter_Batch_3/out_V] [get_bd_intf_pins ConvolutionInputGenerator_2/in0_V]
connect_bd_intf_net [get_bd_intf_pins StreamingDataWidthConverter_Batch_4/out_V] [get_bd_intf_pins MatrixVectorActivation_2/in0_V]
connect_bd_intf_net [get_bd_intf_pins StreamingFIFO_0/out_V] [get_bd_intf_pins Thresholding_Batch_0/in0_V]
connect_bd_intf_net [get_bd_intf_pins StreamingFIFO_1/out_V] [get_bd_intf_pins ConvolutionInputGenerator_0/in0_V]
connect_bd_intf_net [get_bd_intf_pins StreamingFIFO_5/out_V] [get_bd_intf_pins ConvolutionInputGenerator_1/in0_V]
connect_bd_intf_net [get_bd_intf_pins StreamingFIFO_6/out_V] [get_bd_intf_pins StreamingDataWidthConverter_Batch_2/in0_V]
connect_bd_intf_net [get_bd_intf_pins StreamingFIFO_7/out_V] [get_bd_intf_pins MatrixVectorActivation_1/in0_V]
connect_bd_intf_net [get_bd_intf_pins StreamingFIFO_9/out_V] [get_bd_intf_pins StreamingDataWidthConverter_Batch_3/in0_V]
connect_bd_intf_net [get_bd_intf_pins StreamingMaxPool_Batch_0/out_V] [get_bd_intf_pins StreamingFIFO_9/in0_V]
connect_bd_intf_net [get_bd_intf_pins Thresholding_Batch_0/out_V] [get_bd_intf_pins StreamingFIFO_1/in0_V]
connect_bd_intf_net -intf_net in0_V_0_1 [get_bd_intf_ports s_axis_0] [get_bd_intf_pins StreamingFIFO_0/in0_V]
connect_bd_intf_net -intf_net s_axilite_0_1 [get_bd_intf_ports s_axilite_0] [get_bd_intf_pins MatrixVectorActivation_0/s_axilite]
connect_bd_intf_net -intf_net s_axilite_1_1 [get_bd_intf_ports s_axilite_1] [get_bd_intf_pins MatrixVectorActivation_1/s_axilite]
connect_bd_intf_net -intf_net s_axilite_2_1 [get_bd_intf_ports s_axilite_2] [get_bd_intf_pins MatrixVectorActivation_2/s_axilite]
connect_bd_intf_net -intf_net s_axilite_3_1 [get_bd_intf_ports s_axilite_3] [get_bd_intf_pins MatrixVectorActivation_3/s_axilite]
connect_bd_intf_net -intf_net s_axilite_4_1 [get_bd_intf_ports s_axilite_4] [get_bd_intf_pins MatrixVectorActivation_4/s_axilite]
connect_bd_intf_net -intf_net s_axilite_5_1 [get_bd_intf_ports s_axilite_5] [get_bd_intf_pins MatrixVectorActivation_5/s_axilite]
connect_bd_net -net ap_clk_0_1 [get_bd_ports ap_clk] \
  [get_bd_pins StreamingFIFO_0/ap_clk] [get_bd_pins Thresholding_Batch_0/ap_clk] [get_bd_pins StreamingFIFO_1/ap_clk] \
  [get_bd_pins ConvolutionInputGenerator_0/ap_clk] [get_bd_pins StreamingDataWidthConverter_Batch_0/ap_clk] \
  [get_bd_pins MatrixVectorActivation_0/ap_clk] [get_bd_pins StreamingDataWidthConverter_Batch_1/ap_clk] \
  [get_bd_pins StreamingFIFO_5/ap_clk] [get_bd_pins ConvolutionInputGenerator_1/ap_clk] [get_bd_pins StreamingFIFO_6/ap_clk] \
  [get_bd_pins StreamingDataWidthConverter_Batch_2/ap_clk] [get_bd_pins StreamingFIFO_7/ap_clk] \
  [get_bd_pins MatrixVectorActivation_1/ap_clk] [get_bd_pins StreamingMaxPool_Batch_0/ap_clk] \
  [get_bd_pins StreamingFIFO_9/ap_clk] [get_bd_pins StreamingDataWidthConverter_Batch_3/ap_clk] \
  [get_bd_pins ConvolutionInputGenerator_2/ap_clk] [get_bd_pins StreamingDataWidthConverter_Batch_4/ap_clk] \
  [get_bd_pins MatrixVectorActivation_2/ap_clk] [get_bd_pins MatrixVectorActivation_3/ap_clk] \
  [get_bd_pins MatrixVectorActivation_4/ap_clk] [get_bd_pins MatrixVectorActivation_5/ap_clk] \
  [get_bd_pins LabelSelect_Batch_0/ap_clk]
connect_bd_net -net ap_rst_n_0_1 [get_bd_ports ap_rst_n] \
  [get_bd_pins StreamingFIFO_0/ap_rst_n] [get_bd_pins Thresholding_Batch_0/ap_rst_n] [get_bd_pins StreamingFIFO_1/ap_rst_n] \
  [get_bd_pins ConvolutionInputGenerator_0/ap_rst_n] [get_bd_pins StreamingDataWidthConverter_Batch_0/ap_rst_n] \
  [get_bd_pins MatrixVectorActivation_0/ap_rst_n] [get_bd_pins StreamingDataWidthConverter_Batch_1/ap_rst_n] \
  [get_bd_pins StreamingFIFO_5/ap_rst_n] [get_bd_pins ConvolutionInputGenerator_1/ap_rst_n] \
  [get_bd_pins StreamingFIFO_6/ap_rst_n] [get_bd_pins StreamingDataWidthConverter_Batch_2/ap_rst_n] \
  [get_bd_pins StreamingFIFO_7/ap_rst_n] [get_bd_pins MatrixVectorActivation_1/ap_rst_n] \
  [get_bd_pins StreamingMaxPool_Batch_0/ap_rst_n] [get_bd_pins StreamingFIFO_9/ap_rst_n] \
  [get_bd_pins StreamingDataWidthConverter_Batch_3/ap_rst_n] [get_bd_pins ConvolutionInputGenerator_2/ap_rst_n] \
  [get_bd_pins StreamingDataWidthConverter_Batch_4/ap_rst_n] [get_bd_pins MatrixVectorActivation_2/ap_rst_n] \
  [get_bd_pins MatrixVectorActivation_3/ap_rst_n] [get_bd_pins MatrixVectorActivation_4/ap_rst_n] \
  [get_bd_pins MatrixVectorActivation_5/ap_rst_n] [get_bd_pins LabelSelect_Batch_0/ap_rst_n]

validate_bd_design
save_bd_design
